# Altium schematic sheet AnalisisAC.SchDoc
size A4; SheetNumber: 8; SheetTotal: 8
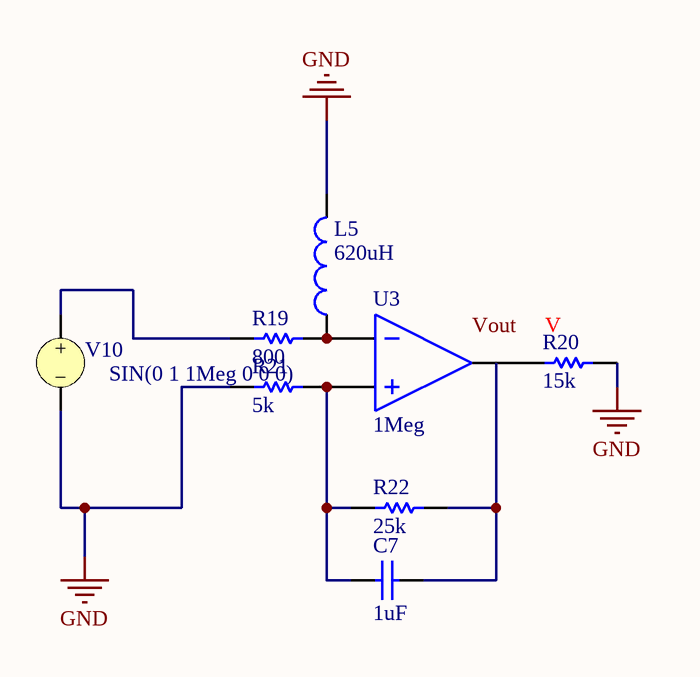
[diagram p0: AnalisisAC.SchDoc]

## Parts
C7  value 1uF  (hidden comment: Capacitor)
L5  value 620uH  (hidden comment: Inductor)
R19  value 800  (hidden comment: Resistor)
R20  value 15k  (hidden comment: Resistor)
R21  value 5k  (hidden comment: Resistor)
R22  value 25k  (hidden comment: Resistor)
U3  GAIN: 1Meg  (hidden comment: Ideal Operational Amplifier)
V10  SIN(0 1 1Meg 0 0 0)

## Nets
GND: L5.2 R20.2 R21.1 V10.2
NetC7_1: C7.1 R22.2
NetC7_2: C7.2 R21.2 R22.1 U3.2(IN+)
NetL5_1: L5.1 R19.2 U3.1(IN-)
NetR19_1: R19.1 V10.1
NetR20_1: R20.1 U3.3(OUT)

## Notes on the sheet
- Labels drawn without touching a wire or pin: Vout

## Library data of the parts
C7 = Capacitor: SimulationGenericComponent: True
L5 = Inductor: SimulationGenericComponent: True
R19-R22 = Resistor: TC1: 0; SimulationGenericComponent: True; TC2: 0
U3 = OpAmp: SimulationGenericComponent: True
V10 = VSRC: Voltage Source; Note: PCB Footprint - Not required; AC Magnitude: 1; AC Phase: 0; DC Magnitude: 5; Published: 8-Jun-2000; LatestRevisionDate: 17-Jul-2002; LatestRevisionNote: Re-released for DXP Platform.; PackageReference: Not Applicable; Publisher: Altium Limited; Offset: 0; Amplitude: 1; Frequency: 1Meg; Delay: 0; Damping Factor: 0; Phase: 0